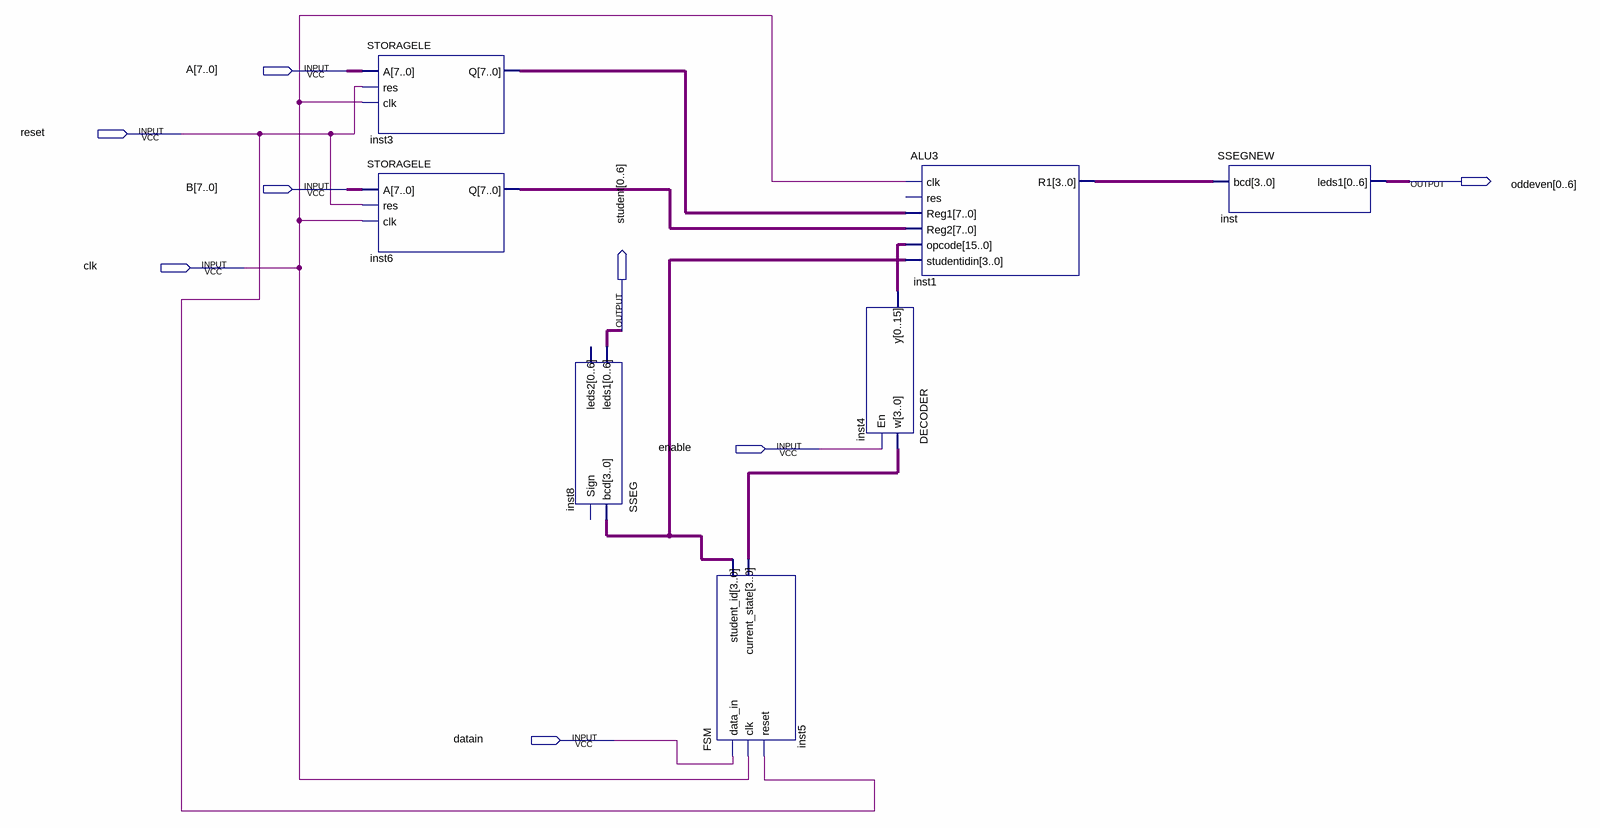
[diagram p0: schematic sheet]
// Quartus schematic FINALPROCESSOR.bdf as structural Verilog: 7 symbols, 8 pins
module FINALPROCESSOR (
  input  [7:0] A,
  input  reset,
  input  [7:0] B,
  input  clk,
  input  enable,
  input  datain,
  output [0:6] oddeven,
  output [0:6] student
);

  wire [3:0] inst1_r1, inst5_current_state, inst5_student_id;
  wire [7:0] inst3_q, inst6_q;
  wire [15:0] inst4_y;

  STORAGELE inst3 (.A(A), .res(reset), .clk(clk), .Q(inst3_q));
  STORAGELE inst6 (.A(B), .res(reset), .clk(clk), .Q(inst6_q));
  SSEG inst8 (.bcd(inst5_student_id), .leds1(student));  // open: Sign, leds2
  FSM inst5 (
    .data_in(datain), .clk(clk), .reset(reset), .student_id(inst5_student_id),
    .current_state(inst5_current_state));
  DECODER inst4 (.w(inst5_current_state), .En(enable), .y(inst4_y));
  ALU3 inst1 (
    .clk(clk), .Reg1(inst3_q), .Reg2(inst6_q), .opcode(inst4_y), .studentidin(inst5_student_id), .R1(inst1_r1));  // open: res
  SSEGNEW inst (.bcd(inst1_r1), .leds1(oddeven));
endmodule
